# EasyEDA Pro project Laser Tanks Motherboard V4.eprj

# Schematic Schematic1
Board Name: Board1; Create Date: 2025-03-12; Page Name: P1; Project Name: Laser Tanks Tank Motherboard; Schematic Name: Schematic1; Update Date: 2025-07-31; Company: EasyEDA.com; Page Size: A4; Version: V1.0
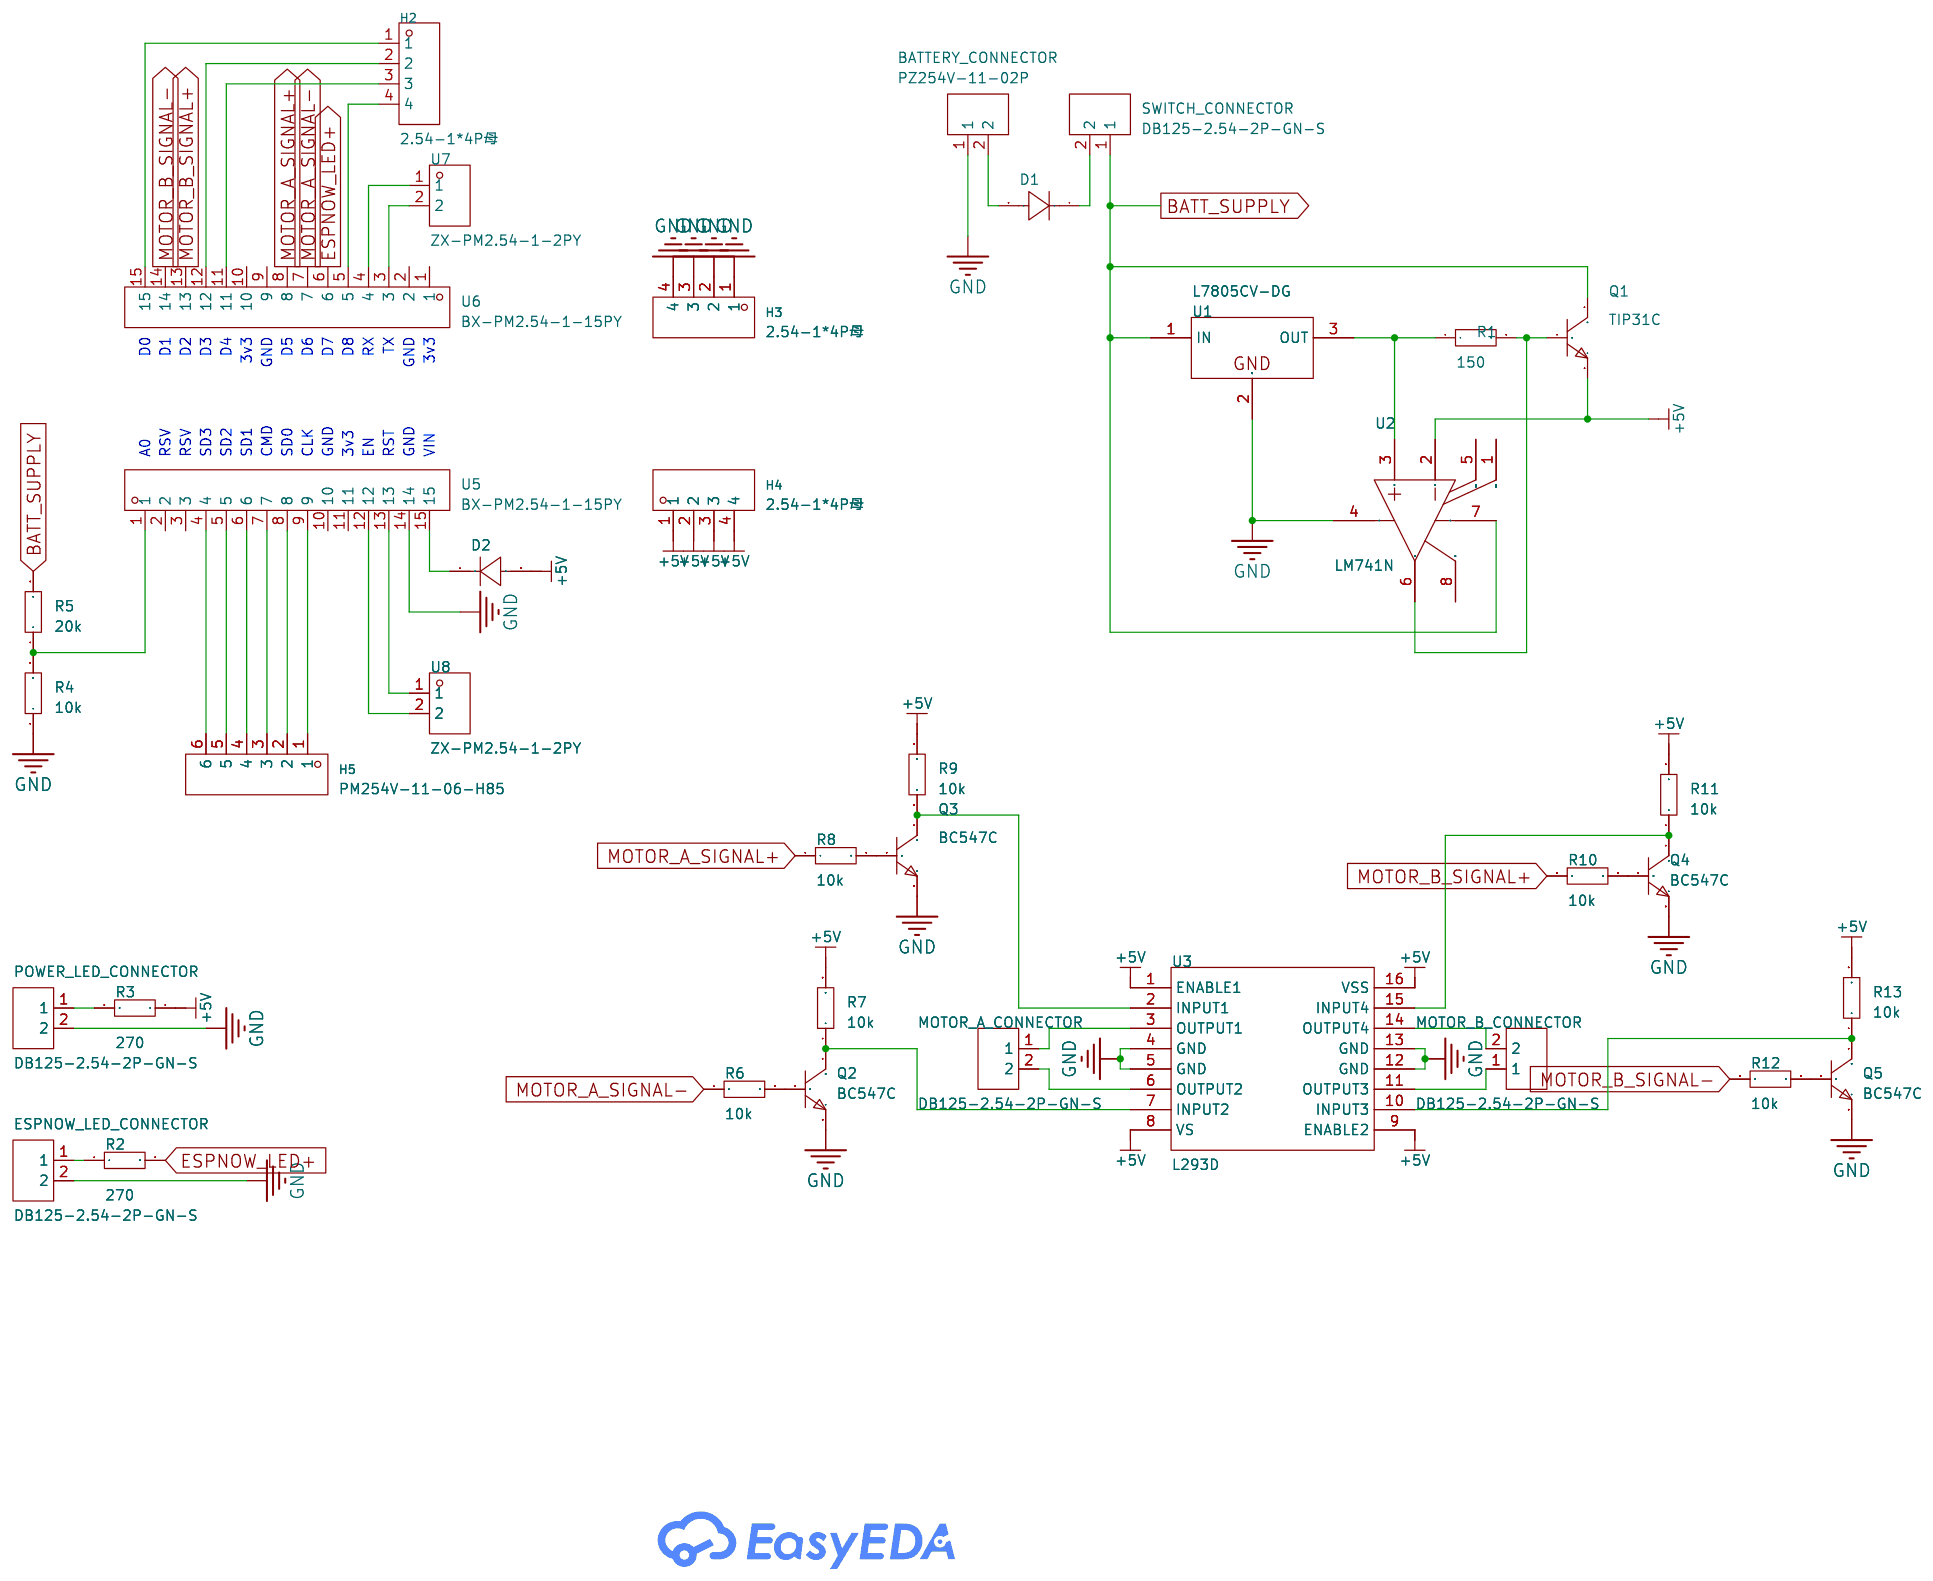
[diagram p0: schematic sheet]

## Parts
BATTERY_CONNECTOR  PZ254V-11-02P  [HDR-TH_2P-P2.54-V-M]
D1  -  [DO-41_BD2.4-L4.7-P8.70-D0.9-RD]
D2  -  [DO-41_BD2.4-L4.7-P8.70-D0.9-RD]
ESPNOW_LED_CONNECTOR  DB125-2.54-2P-GN-S  [CONN-TH_DB125-2.54-2P-GN]
H2  2.54-1*4P母  [HDR-TH_4P-P2.54-V-F]
H3  2.54-1*4P母  [HDR-TH_4P-P2.54-V-F]
H4  2.54-1*4P母  [HDR-TH_4P-P2.54-V-F]
H5  PM254V-11-06-H85  [HDR-TH_6P-P2.54-V-F]
MOTOR_A_CONNECTOR  DB125-2.54-2P-GN-S  [CONN-TH_DB125-2.54-2P-GN]
MOTOR_B_CONNECTOR  DB125-2.54-2P-GN-S  [CONN-TH_DB125-2.54-2P-GN]
POWER_LED_CONNECTOR  DB125-2.54-2P-GN-S  [CONN-TH_DB125-2.54-2P-GN]
Q1  TIP31C  [TO-220-3_L10.0-W4.5-P2.54-T]
Q2  BC547C  [TO-92-3_L4.9-W3.7-P1.27-L]
Q3  BC547C  [TO-92-3_L4.9-W3.7-P1.27-L]
Q4  BC547C  [TO-92-3_L4.9-W3.7-P1.27-L]
Q5  BC547C  [TO-92-3_L4.9-W3.7-P1.27-L]
R1  150  [RES-TH_BD2.3-L6.5-P10.50-D0.5]
R2  270  [RES-TH_BD2.3-L6.5-P10.50-D0.5]
R3  270  [RES-TH_BD2.3-L6.5-P10.50-D0.5]
R4  10k  [RES-TH_BD2.3-L6.5-P10.50-D0.5]
R5  20k  [RES-TH_BD2.3-L6.5-P10.50-D0.5]
R6  10k  [RES-TH_BD2.3-L6.5-P10.50-D0.5]
R7  10k  [RES-TH_BD2.3-L6.5-P10.50-D0.5]
R8  10k  [RES-TH_BD2.3-L6.5-P10.50-D0.5]
R9  10k  [RES-TH_BD2.3-L6.5-P10.50-D0.5]
R10  10k  [RES-TH_BD2.3-L6.5-P10.50-D0.5]
R11  10k  [RES-TH_BD2.3-L6.5-P10.50-D0.5]
R12  10k  [RES-TH_BD2.3-L6.5-P10.50-D0.5]
R13  10k  [RES-TH_BD2.3-L6.5-P10.50-D0.5]
SWITCH_CONNECTOR  DB125-2.54-2P-GN-S  [CONN-TH_DB125-2.54-2P-GN]
U1  L7805CV-DG  [TO-220-3_L10.0-W4.5-P2.54-L]
U2  LM741N  [DIP-8_L9.3-W6.4-P2.54-LS7.6-BL]
U3  L293D  [DIP-16_L20.0-W6.4-P2.54-LS7.6-BL]
U5  BX-PM2.54-1-15PY  [HDR-TH_15P-P2.54-V-F-1]
U6  BX-PM2.54-1-15PY  [HDR-TH_15P-P2.54-V-F-1]
U7  ZX-PM2.54-1-2PY  [HDR-TH_2P-P2.54-V-F]
U8  ZX-PM2.54-1-2PY  [HDR-TH_2P-P2.54-V-F]

## Library data of the parts
BATTERY_CONNECTOR = PZ254V-11-02P: LCSC Part Name: 1x2P 间距:2.54mm 方针 直插; Supplier Part: C492401; Manufacturer: XFCN(兴飞); Supplier Footprint: 插件,P=2.54mm; JLCPCB Part Class: Extended Part; Datasheet: https://atta.szlcsc.com/upload/public/pdf/source/20200309/C492401_A812433581A9B211A7FFA413ADDFF0E5.pdf; Supplier: LCSC; Pin Structure: 1x2P; Pitch: 2.54mm; Circluar Pins/Square Pins: Policy; Mounting Type: Straight; Number of Rows: Single Row; Number of Pins: 2P; Length of Mating Pin: 6mm; Insulation Height: 2.5mm; Length of End Connection Pin: 3mm; Contact Material: Brass; Operating Temperature: -40℃~+105℃; Color: Black
D1 D2 = 1N4007: Supplier Footprint: DO-41
ESPNOW_LED_CONNECTOR MOTOR_A_CONNECTOR MOTOR_B_CONNECTOR POWER_LED_CONNECTOR SWITCH_CONNECTOR = DB125-2.54-2P-GN-S: LCSC Part Name: 2.54mm 1x2P 排数:1 每排P数:2 直插; Supplier Part: C918120; Manufacturer: DORABO(地博电气); Supplier Footprint: 插件,P=2.54mm; JLCPCB Part Class: Extended Part; Datasheet: https://atta.szlcsc.com/upload/public/pdf/source/20230106/BCD3A0BE1EB95DC3E813F1745F022035.pdf; Supplier: LCSC; Number of Positions or Pins: 1x2P; Pitch: 2.54mm; Color: Green; Mounting Type: Direct Insert; Number of Pins: 2P; Number of Rows: 1; Number of PINs Per Row: 2; Current Rating: 8A; Voltage Rating (Max): 130V; Wire Gauge - AWG: 18~26; Wire Gauge - mm2: 0.5~1; Operating Temperature: -40℃~+105℃
H2-H4 = 2.54-1*4P母: LCSC Part Name: 间距:2.54mm 1x4P 直插; Supplier Part: C2718488; Manufacturer: BOOMELE(博穆精密); Supplier Footprint: 插件,P=2.54mm; JLCPCB Part Class: Extended Part; Datasheet: https://atta.szlcsc.com/upload/public/pdf/source/20210301/C2718488_F4427B881E42CAA8DDB0B1C12B3A522C.pdf; Supplier: LCSC; Holes Structure: 1x4P; Pitch: 2.54mm; Circular Hole / Square Hole: Square Holes; Mounting Type: Straight; Number of Rows: Plugin; Number of Holes: 4P; Current Rating (Max): 3A; Holes Direction: Top; Contact Material: bronze; Operating Temperature Range: -40℃~+105℃
H5 = PM254V-11-06-H85: LCSC Part Name: 间距:2.54mm 1x6P 直插; Supplier Part: C2832269; Manufacturer: XFCN(兴飞); Supplier Footprint: 插件,P=2.54mm; JLCPCB Part Class: Extended Part; Datasheet: https://atta.szlcsc.com/upload/public/pdf/source/20210514/C2832269_B3EC97736B37C2783BDCE3050AA57447.pdf; Supplier: LCSC; Holes Structure: 1x6P; Pitch: 2.54mm; Circular Hole / Square Hole: Square Holes; Mounting Type: Straight; Number of Rows: Plugin; Number of Holes: 6P; Current Rating (Max): 3A; Voltage Rating (Max): 250V; Holes Direction: Top; Operating Temperature Range: -40℃~+105℃
Q1 = TIP31C_C13506: LCSC Part Name: NPN 电流:3A 耐压:100V; Supplier Part: C13506; Manufacturer: ST(意法半导体); Supplier Footprint: TO-220; JLCPCB Part Class: Extended Part; Datasheet: https://atta.szlcsc.com/upload/public/pdf/source/20140724/1457707158308.pdf; Supplier: LCSC; DC Current Gain (hFE@Ic,Vce): 10@3A,4V; Collector Cut-Off Current (Icbo): 0.3mA; Collector-Emitter Saturation Voltage (VCE(sat)@Ic,Ib): 1.2V@3A,375mA; Operating Temperature: -65℃~+150℃
Q2-Q5 = BC547C: LCSC Part Name: NPN 电流:100mA 耐压:45V; Supplier Part: C713614; Manufacturer: LGE(鲁光); Supplier Footprint: TO-92-3; JLCPCB Part Class: Extended Part; Datasheet: https://atta.szlcsc.com/upload/public/pdf/source/20200731/C713612_A87215DC84F647A4351B6D1248DC2A9A.pdf; Supplier: LCSC; DC Current Gain (hFE@Ic,Vce): 610@2mA,1V; Transition Frequency (fT): 150MHz; Collector Cut-Off Current (Icbo): 100nA; Collector-Emitter Saturation Voltage (VCE(sat)@Ic,Ib): 300mV; Operating Temperature: -55℃~+150℃
R1-R13 = MF1/4W-4.7KΩ±1% T: Type:Metal Film Resistors Resistance: Tolerance:±1% Tolerance:±1% Voltage-Supply(Max):250V Power(Watts):250mW Temperature Coefficient:±100ppm/℃ Temperature Coefficient:±100ppm/℃ Operating Temperature:-55℃~+155℃ Operating Temperature:-55℃~+155℃; LCSC Part Name: 4.7kΩ ±1% 250mW 金属膜电阻; Supplier Part: C119339; Manufacturer: CCO(千志电子); Supplier Footprint: 插件,D2.3xL6.5mm; JLCPCB Part Class: Extended Part; Datasheet: https://atta.szlcsc.com/upload/public/pdf/source/20190910/C427326_62A6D058BC0FF74963A2F22379CA06CE.pdf; Supplier: LCSC; Type: Metal Film Resistors; Tolerance: ±1%; Voltage-Supply(Max): 250V; Power(Watts): 250mW; Temperature Coefficient: ±100ppm/℃; Operating Temperature: -55℃~+155℃
U1 = L7805CV-DG: LCSC Part Name: 正稳压器IC; Supplier Part: C3795; Manufacturer: ST(意法半导体); Supplier Footprint: TO-220; JLCPCB Part Class: Extended Part; Datasheet: https://atta.szlcsc.com/upload/public/pdf/source/20140724/1457707163191.pdf; Supplier: LCSC; Output Type: Fixed; Maximum Input Voltage: 35V; Output Voltage: 5V; Output Current: 1.5A; Power Supply Rejection Ratio (PSRR): 62dB@(120Hz); Dropout Voltage: 2V@(1A); standby current: 8mA; Feature: Short-Circuit  Protection；Thermal Protection(TSD)；Overcurrent Protection(OCP); Operating Temperature: 0℃~+125℃; Output Polarity: Positive electrode; Number of Outputs: 1
U2 = LM741N: LCSC Part Name: LM741通用运算放大器; Supplier Part: C22446595; Manufacturer: HGSEMI(华冠); Supplier Footprint: DIP-8; JLCPCB Part Class: Extended Part; Datasheet: https://atta.szlcsc.com/upload/public/pdf/source/20240606/252C9569AA98CFB9FE0ED3A6E7F4B9A7.pdf; Supplier: LCSC; Number of Circuits: Single channel; Voltage - Input Offset(Vos): 5mV; Slew Rate(SR): 0.5V/us; Common Mode Rejection Ratio (CMRR): 90dB; Operating Temperature: 0℃~+70℃
U3 = L293D_C12340: LCSC Part Name: 600mA 有刷直流电机驱动芯片 36V; Supplier Part: C12340; Manufacturer: ST(意法半导体); Supplier Footprint: DIP-16; JLCPCB Part Class: Extended Part; Datasheet: https://atta.szlcsc.com/upload/public/pdf/source/20140724/1457707157802.pdf; Supplier: LCSC
U5 U6 = BX-PM2.54-1-15PY: LCSC Part Name: 1x15P 间距:2.54mm 直插; Supplier Part: C18078136; Manufacturer: Bossie(博锡); Supplier Footprint: 插件,P=2.54mm; JLCPCB Part Class: Extended Part; Datasheet: https://atta.szlcsc.com/upload/public/pdf/source/20231017/E7C87C5FAA326EA1BCED90F41F0BE953.pdf; Supplier: LCSC; Holes Structure: 1x15P; Pitch: 2.54mm; Circular Hole / Square Hole: Square Hole; Mounting Type: Direct Insert; Number of Rows: Single Row; Number of Holes: 15P; Voltage Rating (Max): 1kV; Holes Direction: Top; Insulation Height: 8.5mm; Contact Plating: Gold; Operating Temperature Range: -40℃~+105℃; Soldering Temperature(Max): 260℃@5S
U7 U8 = ZX-PM2.54-1-2PY: LCSC Part Name: 1x2P 间距:2.54mm 直插; Supplier Part: C7499322; Manufacturer: Megastar(兆星); Supplier Footprint: 插件,P=2.54mm; JLCPCB Part Class: Extended Part; Datasheet: https://atta.szlcsc.com/upload/public/pdf/source/20231122/F22175ABE3DCBFEB9E36A2E7DA44623C.pdf; Supplier: LCSC; Holes Structure: 1x2P; Pitch: 2.54mm; Circular Hole / Square Hole: Square Hole; Mounting Type: Direct Insert; Number of Rows: Single Row; Number of Holes: 2P; Voltage Rating (Max): 1kV; Holes Direction: Top; Insulation Height: 8.5mm; Contact Plating: Gold; Operating Temperature Range: -40℃~+105℃; Soldering Temperature(Max): 260℃@5S

## Nets
+5V: D2.2(A) H4.1 H4.2 H4.3 H4.4 Q1.3(E) R3.1 R7.2 R9.2 R11.2 R13.2 U2.2(-IN) U3.1(ENABLE1) U3.8(VS) U3.9(ENABLE2) U3.16(VSS)
GND: BATTERY_CONNECTOR.1 ESPNOW_LED_CONNECTOR.2 H3.1 H3.2 H3.3 H3.4 POWER_LED_CONNECTOR.2 Q2.3(E) Q3.3(E) Q4.3(E) Q5.3(E) R4.1 U1.2(GND) U2.4(V-) U3.4(GND) U3.5(GND) U3.12(GND) U3.13(GND) U5.14
BATT_SUPPLY: Q1.2(C) R5.2 SWITCH_CONNECTOR.1 U1.1(IN) U2.7(V+)
ESPNOW_LED+: R2.2 U6.6
MOTOR_A_SIGNAL+: R8.1 U6.8
MOTOR_A_SIGNAL-: R6.1 U6.7
MOTOR_B_SIGNAL+: R10.1 U6.13
MOTOR_B_SIGNAL-: R12.1 U6.14
$1N457: BATTERY_CONNECTOR.2 D1.2(A)
$1N1221: Q1.1(B) R1.2 U2.6(OUT)
$1N2036: R4.2 R5.1 U5.1
$1N10174: Q3.2(B) R8.2
$1N10175: Q2.2(B) R6.2
$1N10193: Q5.2(B) R12.2
$1N10200: Q5.1(C) R13.1 U3.10(INPUT3)
$1N10623: R1.1 U1.3(OUT) U2.3(+IN)
$1N11035: D2.1(K) U5.15
$1N11313: Q4.2(B) R10.2
$1N11315: Q4.1(C) R11.1 U3.15(INPUT4)
$1N11419: Q2.1(C) R7.1 U3.7(INPUT2)
$1N11580: D1.1(K) SWITCH_CONNECTOR.2
$1N11617: MOTOR_B_CONNECTOR.2 U3.14(OUTPUT4)
$1N11623: MOTOR_B_CONNECTOR.1 U3.11(OUTPUT3)
$1N11647: MOTOR_A_CONNECTOR.1 U3.3(OUTPUT1)
$1N11652: MOTOR_A_CONNECTOR.2 U3.6(OUTPUT2)
$1N12198: Q3.1(C) R9.1 U3.2(INPUT1)
$1N14456: H5.6 U5.4
$1N14458: H5.5 U5.5
$1N14460: H5.4 U5.6
$1N14464: H5.2 U5.8
$1N14466: H5.1 U5.9
$1N14472: U5.12 U8.2
$1N14474: U5.13 U8.1
$1N14884: H2.1 U6.15
$1N14895: H2.3 U6.11
$1N14901: H2.4 U6.5
$1N15015: U6.3 U7.2
$1N15020: U6.4 U7.1
$1N17013: H5.3 U5.7
$1N17025: POWER_LED_CONNECTOR.1 R3.2
$1N17035: ESPNOW_LED_CONNECTOR.1 R2.1
$1N19581: H2.2 U6.12

Not connected (* = marked no-connect by the designer): U2 1(OFFSET NULL) 5(OFFSET NULL) 8(NC); U5 2 3 10 11; U6 1 2 9 10

## Notes on the sheet
- D0
- D1
- D2
- D3
- D4
- 3v3
- GND
- D5
- D6
- D7
- D8
- RX
- TX
- GND
- 3v3
- A0
- RSV
- RSV
- SD3
- SD2
- SD1
- CMD
- SD0
- CLK
- GND
- 3v3
- EN
- RST
- GND
- VIN

# Board Original
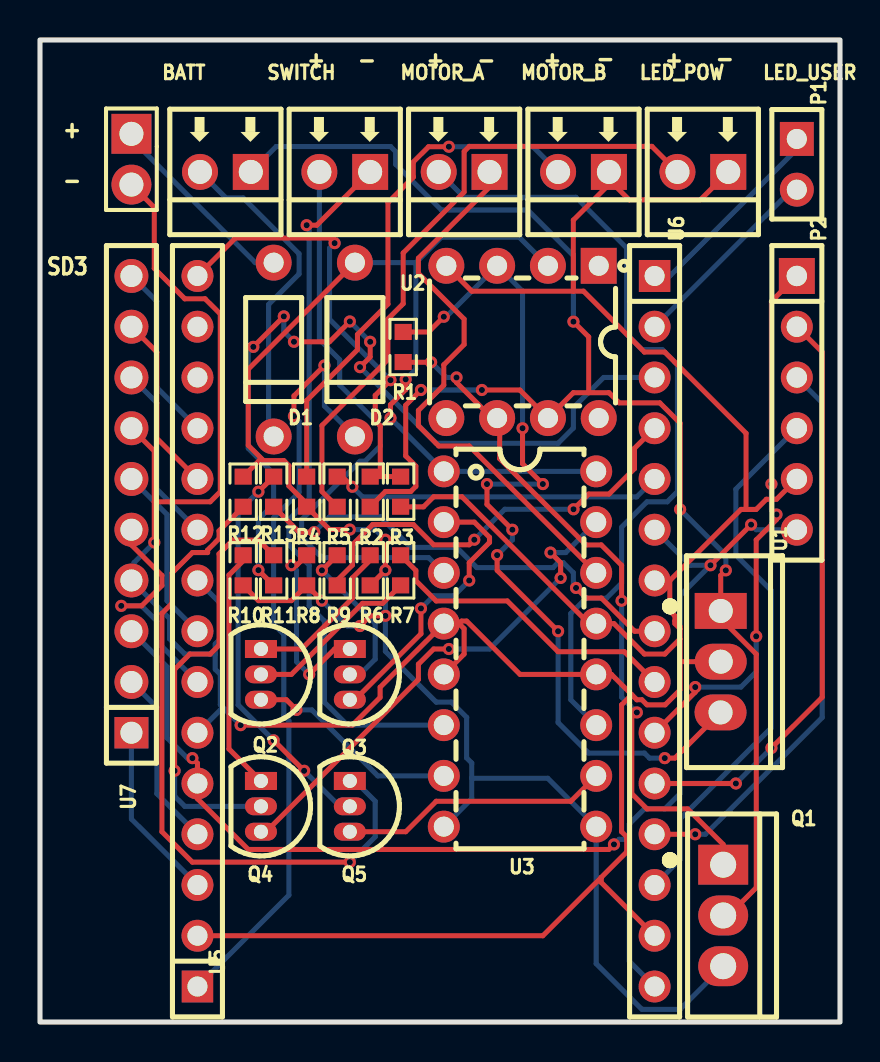
[diagram p1: board, top side]
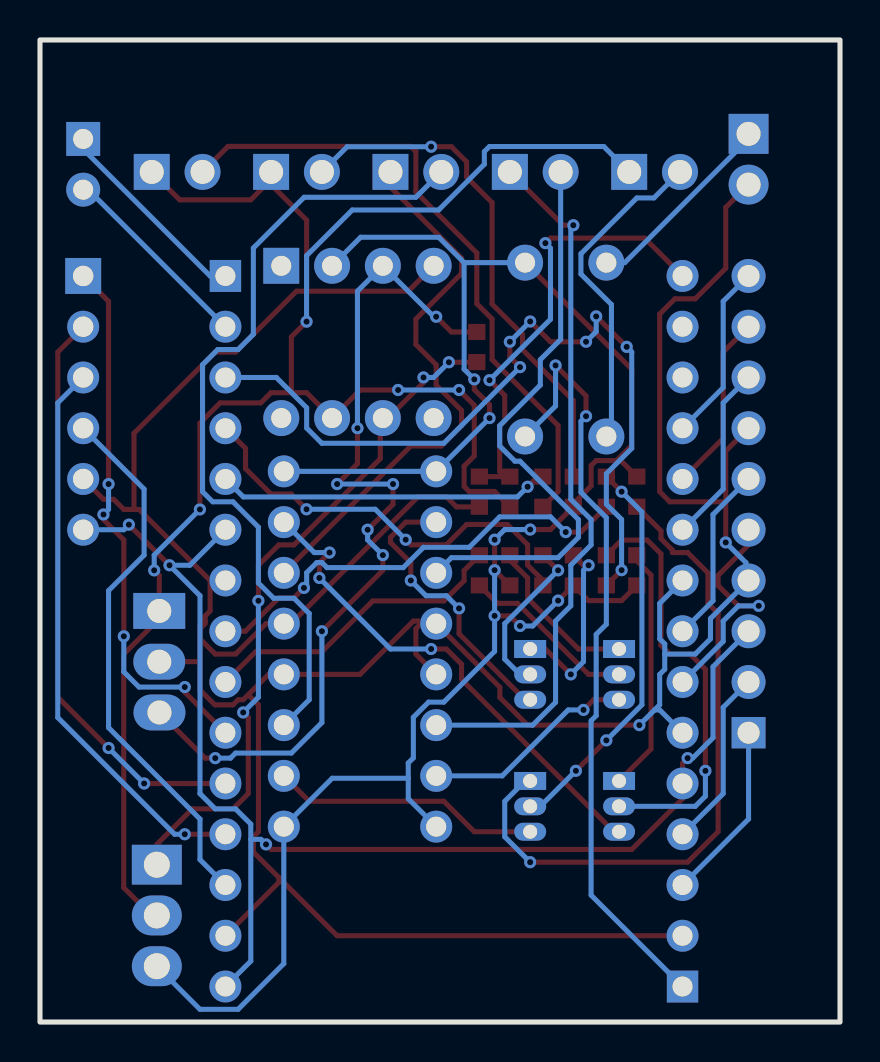
[diagram p2: board, bottom side, seen from below]

Outline 40 x 49.15 mm; copper layers: Top Layer, Bottom Layer. Coordinates in mm from the lower left corner of the outline.
Outline path: rectangle 0,49.15 40,0
Stack: Top Layer 0.035mm / Dielectric1 1.51mm FR4 er 4.5 / Bottom Layer 0.035mm

## Design rules (mm)
template: JLCPCB Capability(Two Layers Board)
spacing copperThickness1oz (default): track to track 0.102, other pairs 0.152 to 0.3
spacing copperThickness2oz: track to track 0.203, other pairs 0.152 to 0.3
track width copperThickness1oz (default): min 0.127, default 0.254, max 2.54
track width copperThickness2oz: min 0.203, default 0.254, max 2.54
differential pair differentialPair (default): width min 0.127, default 0.254, max 2.54; gap min 0.152, default 0.152
via viaSize (default): diameter min 0.5, default 0.61, max 10; hole min 0.3, default 0.305, max 6.3

## Placement (name value [footprint] x y rotation side)
BATT  PZ254V-11-02P  [HDR-TH_2P-P2.54-V-M]  4.57 43.18 270 top
D1  -  [DO-41_BD2.4-L4.7-P8.70-D0.9-RD]  11.68 33.66 90 top
D2  -  [DO-41_BD2.4-L4.7-P8.70-D0.9-RD]  15.75 33.66 90 top
LED_POW  DB125-2.54-2P-GN-S  [CONN-TH_DB125-2.54-2P-GN]  27.18 42.54 180 top
LED_USER  DB125-2.54-2P-GN-S  [CONN-TH_DB125-2.54-2P-GN]  33.15 42.54 180 top
MOTOR_A  DB125-2.54-2P-GN-S  [CONN-TH_DB125-2.54-2P-GN]  15.24 42.54 180 top
MOTOR_B  DB125-2.54-2P-GN-S  [CONN-TH_DB125-2.54-2P-GN]  21.21 42.54 180 top
P1  2.54-1*2P母  [HDR-TH_2P-P2.54-V-F]  37.85 42.93 270 top
P2  2.54-1*6P母  [HDR-TH_6P-P2.54-V-F]  37.85 30.99 270 top
Q1  TIP31C  [TO-220-3_L10.0-W4.5-P2.54-T]  34.16 5.33 0 top
Q2  BC547C  [TO-92-3_L4.9-W3.7-P1.27-L]  11.05 17.4 270 top
Q3  BC547C  [TO-92-3_L4.9-W3.7-P1.27-L]  15.49 17.4 270 top
Q4  BC547C  [TO-92-3_L4.9-W3.7-P1.27-L]  11.05 10.79 270 top
Q5  BC547C  [TO-92-3_L4.9-W3.7-P1.27-L]  15.49 10.79 270 top
R1  220  [R0603]  18.16 33.78 270 top
R2  20k  [R0603]  16.51 26.54 270 top
R3  10k  [R0603]  18.03 26.54 90 top
R4  270  [R0603]  13.34 26.54 90 top
R5  270  [R0603]  14.86 26.54 270 top
R6  1k  [R0603]  16.51 22.61 270 top
R7  1k  [R0603]  18.03 22.61 270 top
R8  1k  [R0603]  13.34 22.61 270 top
R9  1k  [R0603]  14.86 22.61 90 top
R10  1k  [R0603]  10.16 22.61 270 top
R11  1k  [R0603]  11.68 22.61 90 top
R12  1k  [R0603]  10.16 26.54 90 top
R13  1k  [R0603]  11.68 26.54 90 top
SWITCH  DB125-2.54-2P-GN-S  [CONN-TH_DB125-2.54-2P-GN]  9.27 42.54 180 top
U1  L7805CV-DG  [TO-220-3_L10.0-W4.5-P2.54-L]  34.04 18.03 270 top
U2  LM741N  [DIP-8_L9.3-W6.4-P2.54-LS7.6-BL]  24.13 34.04 180 top
U3  L293D  [DIP-16_L20.0-W6.4-P2.54-LS7.6-BL]  24 18.67 270 top
U5  BX-PM2.54-1-15PY  [HDR-TH_15P-P2.54-V-F-1]  7.87 19.56 90 top
U6  BX-PM2.54-1-15PY  [HDR-TH_15P-P2.54-V-F-1]  30.73 19.56 270 top
U7  PM2.54-1*10  [HDR-TH_10P-P2.54-V-F]  4.57 25.91 90 top

## Footprints (pads in the part's own frame, mm; a bottom-side part is the same pattern mirrored in y, then rotated)
CONN-TH_DB125-2.54-2P-GN
  rect 1.8x1.8 hole 1.2: 1(-1.27,0)
  round 1.8 hole 1.2: 2(1.27,0)
DIP-8_L9.3-W6.4-P2.54-LS7.6-BL
  rect 1.8x1.8 hole 1: 1(-3.81,-3.81)
  round 1.8 hole 1: 2(-1.27,-3.81) 3(1.27,-3.81) 4(3.81,-3.81) 5(3.81,3.81) 6(1.27,3.81) 7(-1.27,3.81) 8(-3.81,3.81)
DIP-16_L20.0-W6.4-P2.54-LS7.6-BL
  round 1.6 hole 1: 1(-8.89,-3.81) 2(-6.35,-3.81) 3(-3.81,-3.81) 4(-1.27,-3.81) 5(1.27,-3.81) 6(3.81,-3.81) 7(6.35,-3.81) 8(8.89,-3.81) 9(8.89,3.81) 10(6.35,3.81) 11(3.81,3.81) 12(1.27,3.81) 13(-1.27,3.81) 14(-3.81,3.81) 15(-6.35,3.81) 16(-8.89,3.81)
DO-41_BD2.4-L4.7-P8.70-D0.9-RD
  round 1.8 hole 1: 1(-4.35,0) 2(4.35,0)
HDR-TH_2P-P2.54-V-F
  rect 1.7x1.7 hole 1: 1(-1.27,0)
  round 1.7 hole 1: 2(1.27,0)
HDR-TH_2P-P2.54-V-M
  rect 2x2 hole 1.2: 1(-1.27,0)
  round 2 hole 1.2: 2(1.27,0)
HDR-TH_6P-P2.54-V-F
  rect 1.8x1.8 hole 1.02: 1(-6.35,0)
  round 1.6 hole 1.02: 2(-3.81,0) 3(-1.27,0) 4(1.27,0) 5(3.81,0) 6(6.35,0)
HDR-TH_10P-P2.54-V-F
  rect 1.575x1.7 hole 1.1: 1(-11.43,0)
  round 1.7 hole 1.1: 2(-8.89,0) 3(-6.35,0) 4(-3.81,0) 5(-1.27,0) 6(1.27,0) 7(3.81,0) 8(6.35,0) 9(8.89,0) 10(11.43,0)
HDR-TH_15P-P2.54-V-F-1
  rect 1.6x1.575 hole 1: 1(-17.78,0)
  round 1.6 hole 1: 2(-15.24,0) 3(-12.7,0) 4(-10.16,0) 5(-7.62,0) 6(-5.08,0) 7(-2.54,0) 8(0,0) 9(2.54,0) 10(5.08,0) 11(7.62,0) 12(10.16,0) 13(12.7,0) 14(15.24,0) 15(17.78,0)
R0603
  rect 0.806x0.864 smd: 1(-0.753,0) 2(0.753,0)
TO-92-3_L4.9-W3.7-P1.27-L
  rect 0.9x1.6 hole 0.7: 1(-1.27,0)
  oval 0.9x1.6 hole 0.7: 2(0,0) 3(1.27,0)
TO-220-3_L10.0-W4.5-P2.54-L
  rect 1.8x2.6 hole 1.2: 1(-2.54,0.005)
  oval 1.8x2.6 hole 1.2: 2(0,0.005) 3(2.54,-0.005)
TO-220-3_L10.0-W4.5-P2.54-T
  rect 2.5x2 hole 1.3: 1(0,2.54)
  oval 2.5x2 hole 1.3: 2(0,0) 3(0,-2.54)

## Nets
3V3: P2.6 U5.5 U6.6 U6.15 U7.3
GND: BATT.2 LED_POW.1 LED_USER.1 P2.5 R3.1 U1.2 U2.4 U3.4 U3.5 U3.12 U3.13 U5.2 U5.6 U5.9 U6.7 U6.14 U7.4 U7.7
VIN: D2.1 U5.1
A0: R2.1 R3.2 U5.15
BATT+: BATT.1 D1.2
BATT_SUPPLY: Q1.2 R2.2 SWITCH.1 U1.1 U2.7
CIRCUIT_SUPPLY: D2.2 Q1.3 R4.1 R6.2 R8.2 R10.2 R12.2 U2.2 U3.1 U3.8 U3.9 U3.16
CIRCUIT_SUPPLY_FEEDBACK: Q1.1 R1.2 U2.6
CLK: U5.7 U7.5
D0: P1.1 U6.1
D1: P1.2 U6.2
D2: R11.1 U6.3
D3: R9.1 U6.4
D4: R5.1 U6.5
D5: R13.1 U6.8
D6: R7.1 U6.9
D7: P2.1 U6.10
D8: P2.2 U6.11
EN: U5.4 U7.2
ESPNOW_LED+: LED_USER.2 R5.2
MOTOR_A+: MOTOR_A.2 U3.3
MOTOR_A-: MOTOR_A.1 U3.6
MOTOR_B+: MOTOR_B.2 U3.11
MOTOR_B-: MOTOR_B.1 U3.14
POWER_LED+: LED_POW.2 R4.2
RST: U5.3 U7.1
RSV_1: U5.14
RSV_2: U5.13
RX: P2.3 U6.12
SD0: U5.8 U7.6
SD1: U5.10 U7.8
SD2: U5.11 U7.9
SD3: U5.12 U7.10
SWITCH_A: D1.1 SWITCH.2
TX: P2.4 U6.13
$1N854: R1.1 U1.3 U2.3
$1N2650: Q2.1 R6.1
$1N2706: Q2.2 R7.2
$1N2823: Q3.1 R8.1
$1N2827: Q3.2 R9.2
$1N3129: Q3.3 U3.2
$1N3133: Q2.3 U3.7
$1N3356: Q4.1 R10.1
$1N3360: Q4.2 R11.2
$1N3364: Q5.1 R12.1
$1N3368: Q5.2 R13.2
$1N3378: Q4.3 U3.15
$1N3382: Q5.3 U3.10

Pads without a net: U2 1 5 8

## Via types
v1: diameter 0.61, hole 0.305, Top Layer to Bottom Layer, 71 vias

## Routing (per net, layer and track width the routed paths; a pad name or vN(x,y) marks a point on that pad's centre or on a via; arc(x,y) is an arc through that point)
3V3: length 65.4
  Top Layer w0.254: v1(28.7,8.89) 28.45,8.64 10.41,8.64 7.87,11.18 U5.5 7.87,12.95 v1(7.62,13.21) ; v1(35.56,24.89) v1(33.53,22.86)
  Bottom Layer w0.254: 29.46,9.14 28.96,9.14 v1(28.7,8.89) ; 29.46,9.14 29.46,3.05 U6.15 ; 29.46,9.14 29.46,9.91 30.23,10.67 31.24,10.67 32,11.43 32,21.34 v1(33.53,22.86) 32.51,22.86 U6.6 ; v1(7.62,13.21) 7.37,13.21 6.35,14.22 6.35,17.78 U7.3 ; P2.6 35.81,24.64 v1(35.56,24.89)
GND: length 182.6
  Top Layer w0.254: 29.59,16.38 28.57,17.4 U3.12 24,17.4 21.34,20.07 21.08,20.07 20.96,19.94 ; 29.59,16.38 29.84,16.13 30.1,16.13 30.35,15.88 31.26,15.88 32,16.62 32,18.03 ; 29.59,16.38 29.08,15.88 29.08,9.52 29.34,9.27 29.34,8.51 28.07,7.24 ; 31.5,22.1 31.5,20.57 31.75,20.32 31.75,20.07 ; 31.5,22.1 U6.7 ; 31.5,22.1 35.05,25.65 35.31,25.65 ; U5.2 25.15,4.32 28.07,7.24 ; 28.07,7.24 28.07,6.98 U6.14 ; 31.75,20.07 31.75,19.94 32,19.68 ; 31.75,20.07 32,19.81 32,19.68 ; 28.45,42.16 28.45,41.91 26.67,40.13 26.67,36.58 ; 28.45,42.16 LED_POW.1 ; 28.45,42.16 29.46,41.15 33.02,41.15 LED_USER.1 ; 32,18.03 32,19.18 ; 32,18.03 U1.2 ; P2.5 36.83,26.16 36.32,26.16 35.81,25.65 35.31,25.65 ; R3.1 18.04,25.78 19.18,25.78 19.69,26.29 21.1,26.29 27.45,19.94 U3.13 28.7,19.94 30.23,18.41 31.24,18.41 32,19.18 ; 32,19.18 32,19.68 ; 26.67,36.58 27.18,36.58 30.23,33.53 31.24,33.53 35.31,29.46 35.31,25.65 ; 26.67,36.58 21.59,36.58 U2.4 ; BATT.2 5.72,40.77 5.72,37.72 7.24,36.19 8.25,36.19 9.02,35.43 9.02,26.54 8.51,26.03 5.72,26.03 ; 20.96,19.94 21.21,19.68 21.21,18.41 U3.5 ; 20.96,19.94 U3.4 17.01,16.75 17.01,16.25 15.62,14.86 v1(10.03,14.86) ; 5.72,26.03 5.72,28.57 U7.7 ; 5.72,26.03 v1(5.72,24)
  Bottom Layer w0.254: 4.7,21.97 6.48,20.19 6.48,19.18 7.24,18.41 8.76,18.41 ; 4.7,21.97 4.7,22.99 v1(5.72,24) ; 4.7,21.97 U7.4 ; 8.76,18.41 8.76,17.65 9.02,17.4 9.02,15.88 9.27,15.62 ; 8.76,18.41 8.76,18.92 9.02,19.18 9.02,20.95 U5.9 ; 9.27,15.62 9.02,15.62 U5.6 ; 9.27,15.62 v1(10.03,14.86)
VIN: length 38.7
  Top Layer w0.254: v1(12.7,30.32) 12.7,31.34 v1(14.22,32.86)
  Bottom Layer w0.254: v1(14.22,32.86) 14.22,30.83 D2.1 ; U5.1 12.45,6.35 12.45,15.08 12.19,15.33 12.19,19.4 11.68,19.91 11.68,25.24 12.95,26.51 12.95,30.07 v1(12.7,30.32)
A0: length 22.9
  Top Layer w0.254: v1(17.53,32.12) 16.76,31.36 16.76,30.09 17.02,29.84 17.02,27.55 16.76,27.3 ; U5.15 9.77,39.23 14.48,39.23 v1(14.73,38.98) ; R2.1 16.76,27.3 ; 16.76,27.3 R3.2
  Bottom Layer w0.254: v1(17.53,32.12) 14.48,35.17 14.48,38.73 v1(14.73,38.98)
BATT+: length 9.9
  Bottom Layer w0.254: D1.2 10.76,38 4.67,44.1 4.67,44.35 BATT.1
BATT_SUPPLY: length 76.5
  Top Layer w0.254: v1(22.1,31.63) 23.99,31.63 25.4,30.23 26.67,31.5 27.44,31.5 ; v1(34.3,22.61) 34.04,22.35 U1.1 34.04,20.19 35.82,18.41 35.82,6.73 34.43,5.33 Q1.2 ; v1(26.68,35.05) 27.44,34.29 27.44,31.5 ; v1(32.01,25.65) 32.01,29.97 30.99,30.99 28.96,30.99 28.45,31.5 27.44,31.5 ; R2.2 17.27,26.55 18.54,26.55 18.8,26.81 18.8,27.82 18.29,28.33 18.29,30.87 v1(19.05,31.63)
  Bottom Layer w0.254: v1(32.01,25.65) 34.3,23.37 v1(34.3,22.61) ; SWITCH.1 11.81,43.81 17.53,43.81 17.78,43.56 17.78,42.93 20.07,40.64 24.39,40.64 26.68,38.35 v1(26.68,35.05) ; v1(22.1,31.63) v1(19.05,31.63)
CIRCUIT_SUPPLY: length 102
  Top Layer w0.254: v1(17.27,20.33) 16.51,20.33 v1(16,19.82) ; 11.18,28.1 10.96,28.1 R12.2 ; 11.18,28.1 10.41,28.86 10.41,32.67 D2.2 ; 11.18,28.1 12.19,28.1 12.45,27.84 12.45,26.83 13.21,26.07 13.21,25.92 14.48,24.65 v1(15.49,24.65) ; v1(17.53,30.23) 17.53,30.89 18.29,31.66 v1(18.29,32.16) ; R10.2 10.92,21.09 12.57,21.09 R8.2 v1(14.1,21.09) ; R6.2 v1(17.27,22.61) v1(17.27,24.14)
  Bottom Layer w0.254: v1(17.53,30.23) U3.1 U3.16 ; 21.59,12.2 25.39,12.2 U3.9 27.81,2.92 30.1,0.63 32,0.63 34.16,2.79 ; 21.59,12.2 21.59,11.18 U3.8 ; 21.59,12.2 21.59,12.96 21.34,13.22 21.34,15.25 20.57,16.01 19.81,16.01 17.27,18.55 v1(17.27,20.33) v1(17.27,22.61) ; D2.2 18.8,38 ; 18.8,38 20.07,39.27 23.97,39.27 U2.2 ; 18.8,38 18.8,32.67 v1(18.29,32.16) ; v1(17.27,24.14) 16.76,24.65 v1(15.49,24.65) ; v1(14.1,21.09) 15.37,19.82 v1(16,19.82)
CIRCUIT_SUPPLY_FEEDBACK: length 34.9
  Top Layer w0.254: v1(29.08,21.08) 29.08,22.86 28.07,23.88 27.31,23.88 22.99,28.19 22.99,30.1 22.86,30.23 22.61,30.23 20.83,32 v1(20.83,32.26) ; Q1.1 34.16,8.89 32.38,10.67 30.35,10.67 29.59,11.43 29.59,15.24 v1(29.84,15.49) ; v1(19.56,33.02) 18.17,33.02 R1.2
  Bottom Layer w0.254: v1(29.08,21.08) 29.08,16.26 v1(29.84,15.49) ; v1(19.56,33.02) 20.32,32.26 v1(20.83,32.26)
CLK: length 11.9
  Top Layer w0.254: U7.5 4.57,23.88 6.1,22.35 6.1,21.84 5.08,20.83 v1(4.06,20.83)
  Bottom Layer w0.254: v1(4.06,20.83) 5.08,20.83 5.84,20.07 5.84,19.05 7.87,17.02
D0: length 10.3
  Bottom Layer w0.254: U6.1 31.5,37.34 37.85,43.69 P1.1
D1: length 10
  Bottom Layer w0.254: P1.2 37.59,41.66 U6.2
D2: length 41.2
  Top Layer w0.254: v1(16.51,34.04) 16.51,33.28 v1(16,32.77) ; R11.1 v1(10.92,22.61) ; v1(10.67,33.79) v1(12.19,35.31) ; v1(15.49,35.06) 14.48,34.04 v1(12.7,34.04)
  Bottom Layer w0.254: v1(12.19,35.31) 12.19,34.55 v1(12.7,34.04) ; v1(10.67,33.79) 10.41,33.54 10.41,28.71 11.68,27.44 11.68,25.92 10.92,25.15 v1(10.92,22.61) ; v1(16,32.77) 19.81,28.96 25.91,28.96 26.67,29.73 26.67,30.74 28.19,32.26 U6.3 ; v1(15.49,35.06) v1(16.51,34.04)
D3: length 21.3
  Top Layer w0.254: v1(21.72,24.14) 21.46,23.88 19.69,23.88 18.67,24.9 16.64,24.9 15.62,23.88 15.62,22.87 14.86,22.11 R9.1 ; v1(26.68,25.66) 27.44,26.42 28.46,26.42 29.73,27.69 29.73,28.71 U6.4
  Bottom Layer w0.254: v1(26.68,25.66) 23.24,25.66 v1(21.72,24.14)
D4: length 16.7
  Top Layer w0.254: v1(15.62,26.79) 15.11,27.3 R5.1
  Bottom Layer w0.254: v1(15.62,26.79) 16.13,26.28 29.84,26.28 U6.5
D5: length 22.8
  Top Layer w0.254: U6.8 29.74,19.56 28.08,21.22 27.31,21.22 v1(26.81,21.73) ; v1(13.72,24.52) 12.95,24.52 R13.1
  Bottom Layer w0.254: v1(26.81,21.73) 26.67,21.86 26.67,22.49 26.16,23 25.91,23 25.65,22.74 21.84,22.74 20.83,23.76 18.54,23.76 17.02,25.28 14.48,25.28 v1(13.72,24.52)
D6: length 15.6
  Top Layer w0.254: 30.73,17.02 29.22,18.53 25.91,18.53 23.37,21.07 19.81,21.07 18.8,22.09 18.8,22.6 R7.1
D7: length 27.4
  Top Layer w0.254: v1(35.81,19.3) 35.81,24.13 36.83,25.15 v1(36.83,25.4) ; P2.1 36.58,36.07 v1(36.58,26.92) ; v1(32.77,16.76) 32.77,16.51 U6.10
  Bottom Layer w0.254: v1(32.77,16.76) 35.05,16.76 35.81,17.53 v1(35.81,19.3) ; v1(36.58,26.92) 36.58,25.65 v1(36.83,25.4)
D8: length 29.2
  Top Layer w0.254: v1(36.58,13.72) 39.12,16.26 39.12,33.53 P2.2 ; v1(34.8,11.94) U6.11
  Bottom Layer w0.254: v1(36.58,13.72) v1(34.8,11.94)
EN: length 9
  Bottom Layer w0.254: U5.4 5.84,11.43 5.84,15.75 U7.2
ESPNOW_LED+: length 32.3
  Top Layer w0.254: LED_USER.2 30.6,43.82 21.46,43.82 21.21,43.57 21.21,41.54 18.16,38.49 18.16,35.95 17.4,35.19 17.4,33.16 14.1,29.85 14.1,26.55 R5.2
MOTOR_A+: length 29.2
  Bottom Layer w0.254: MOTOR_A.2 13.97,34.16 14.99,33.15 14.99,31.88 17.02,29.84 17.02,28.83 16.26,28.07 16,28.07 13.08,25.15 13.08,24.26 14.1,23.24 19.43,23.24 U3.3
MOTOR_A-: length 35.8
  Top Layer w0.254: 16.51,42.54 13.84,39.88 v1(13.34,39.88)
  Bottom Layer w0.254: U3.6 15.37,14.86 14.22,16 14.22,20.07 13.46,20.83 13.46,22.86 12.45,23.88 12.45,25.15 13.46,26.16 13.46,39.75 v1(13.34,39.88)
MOTOR_B+: length 40.4
  Bottom Layer w0.254: U3.11 26.54,16.13 26.54,20.45 27.31,21.21 28.32,21.21 29.08,21.97 29.08,24.77 30.35,26.03 31.37,26.03 31.88,26.54 31.88,32.89 31.12,33.66 30.1,33.66 29.34,34.42 29.34,38.73 26.8,41.27 21.21,41.27 MOTOR_B.2
MOTOR_B-: length 28
  Top Layer w0.254: U3.14 21.46,28.83 19.94,28.83 18.92,29.84 18.92,30.61 20.19,31.88 20.19,32.89 21.21,33.91 21.21,35.18 18.92,37.46 18.92,38.23 22.48,41.78 MOTOR_B.1
POWER_LED+: length 26
  Top Layer w0.254: R4.2 13.34,31.11 15.88,33.65 15.88,34.41 17.4,35.93 17.4,41.01 18.67,42.28 18.67,43.04 19.43,43.81 v1(20.45,43.81)
  Bottom Layer w0.254: v1(20.45,43.81) 24.65,43.81 25.91,42.54
RST: length 9
  Bottom Layer w0.254: U7.1 4.57,10.16 U5.3
RX: length 28.3
  Top Layer w0.254: v1(32.77,9.4) U6.12
  Bottom Layer w0.254: v1(32.77,9.4) 33.27,9.4 39.12,15.24 39.12,30.99 P2.3
SD0: length 9
  Bottom Layer w0.254: U5.8 6.35,21.08 6.35,25.4 U7.6
SD1: length 9
  Bottom Layer w0.254: U5.10 5.84,26.67 5.84,30.99 U7.8
SD2: length 9
  Top Layer w0.254: U5.11 5.84,29.21 5.84,33.53 U7.9
SD3: length 9
  Bottom Layer w0.254: U7.10 5.84,36.07 5.84,31.75 U5.12
SWITCH_A: length 16.5
  Bottom Layer w0.254: D1.1 11.43,29.56 11.43,35.91 12.95,37.43 12.95,38.45 10.16,41.24 9.3,41.24 SWITCH.2
TX: length 27.3
  Bottom Layer w0.254: U6.13 32,8.13 32,10.16 36.58,14.73 36.58,21.59 34.8,23.37 34.8,26.67 P2.4
$1N854: length 44.6
  Top Layer w0.254: v1(23.62,24.64) 22.35,25.91 v1(22.35,26.92) ; v1(25.91,19.56) 22.86,22.61 v1(22.86,23.37) ; R1.1 19.43,34.54 v1(20.19,35.3) ; v1(31.24,13.21) 31.75,13.21 34.03,15.49 ; v1(25.15,26.92) 24.13,27.94 v1(24.13,29.72)
  Bottom Layer w0.254: v1(23.62,24.64) 23.62,24.13 v1(22.86,23.37) ; v1(20.19,35.3) 20.31,35.3 22.86,37.85 24.13,36.58 v1(24.13,29.72) ; v1(31.24,13.21) 30.48,13.21 30.23,13.46 27.43,13.46 25.91,14.99 v1(25.91,19.56) ; v1(25.15,26.92) v1(22.35,26.92)
$1N2650: length 8.1
  Top Layer w0.254: Q2.1 13.08,18.67 15.62,21.21 15.62,22.22 16.51,23.11 R6.1
$1N2706: length 8.8
  Top Layer w0.254: R7.2 17.14,20.95 16.13,20.95 12.57,17.4 Q2.2
$1N2823: length 9.4
  Top Layer w0.254: R8.1 12.84,22.86 v1(12.57,22.86) ; Q3.1 14.73,18.67 v1(13.46,17.4)
  Bottom Layer w0.254: v1(13.46,17.4) 12.83,18.03 12.83,22.61 v1(12.57,22.86)
$1N2827: length 8.2
  Top Layer w0.254: v1(14.1,22.61) R9.2
  Bottom Layer w0.254: Q3.2 16,17.4 16.76,18.16 16.76,19.94 v1(14.1,22.61)
$1N3129: length 14.4
  Top Layer w0.254: U3.2 21.72,25.02 22.48,24.26 22.48,24 21.46,22.99 v1(21.46,22.1) ; Q3.3 15.75,16.13 19.05,19.43 v1(19.05,20.7)
  Bottom Layer w0.254: v1(19.05,20.7) 19.69,21.34 20.7,21.34 v1(21.46,22.1)
$1N3133: length 10.7
  Top Layer w0.254: v1(12.83,15.62) 12.32,16.13 Q2.3
  Bottom Layer w0.254: U3.7 16.89,12.32 13.59,15.62 v1(12.83,15.62)
$1N3356: length 12.3
  Top Layer w0.254: Q4.1 9.45,13.66 9.45,22.37 10.16,23.08 R10.1
$1N3360: length 21.5
  Top Layer w0.254: v1(6.73,12.57) 6.73,17.65 7.49,18.41 8.51,18.41 8.95,18.86 8.95,23.43 9.64,24.12 10.92,24.12 R11.2
  Bottom Layer w0.254: Q4.2 7.24,10.79 6.73,11.3 v1(6.73,12.57)
$1N3364: length 33.7
  Top Layer w0.254: v1(15.49,8) 7.62,8 6.1,9.52 6.1,20.45 6.6,20.95 6.6,22.48 7.62,23.49 8.38,23.49 8.38,23.62 8.95,24.19 8.95,24.58 R12.1
  Bottom Layer w0.254: v1(15.49,8) 16.76,9.27 16.76,11.05 15.75,12.06 Q5.1
$1N3368: length 19.9
  Top Layer w0.254: v1(10.92,26.54) R13.2 ; v1(13.21,12.57) v1(11.68,14.1)
  Bottom Layer w0.254: v1(13.21,12.57) 14.99,10.79 Q5.2 ; v1(11.68,14.1) 9.91,15.88 9.91,25.53 v1(10.92,26.54)
$1N3378: length 25.1
  Top Layer w0.254: v1(26.03,22.22) 26.03,22.99 v1(25.53,23.49) ; v1(20.45,18.67) 19.69,18.67 18.92,17.91 18.92,17.14 11.3,9.52 Q4.3
  Bottom Layer w0.254: v1(20.45,18.67) 22.48,18.67 v1(26.03,22.22) ; v1(25.53,23.49) 26.29,23.49 U3.15
$1N3382: length 13.5
  Top Layer w0.254: U3.10 26.54,11.05 19.81,11.05 18.29,9.52 Q5.3

## Text on the board
Top Silkscreen Layer: + | - | SD3

# Board PCB3
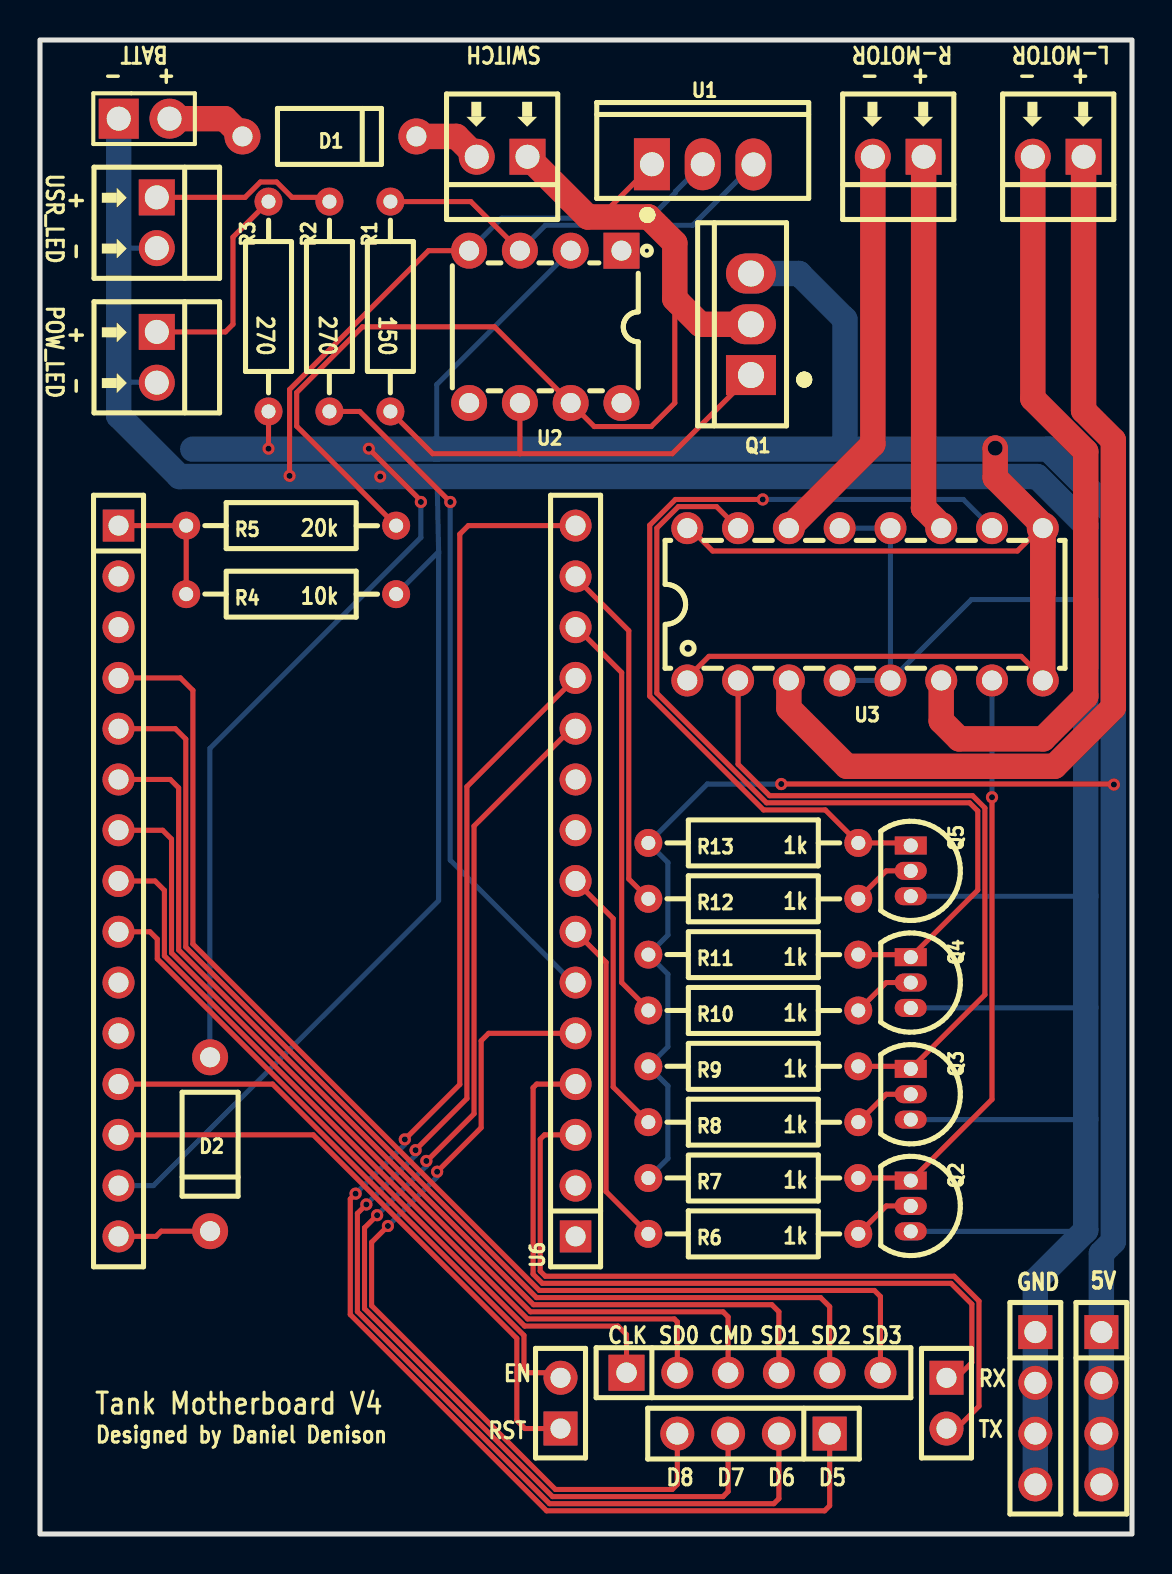
[diagram p3: board, top side]
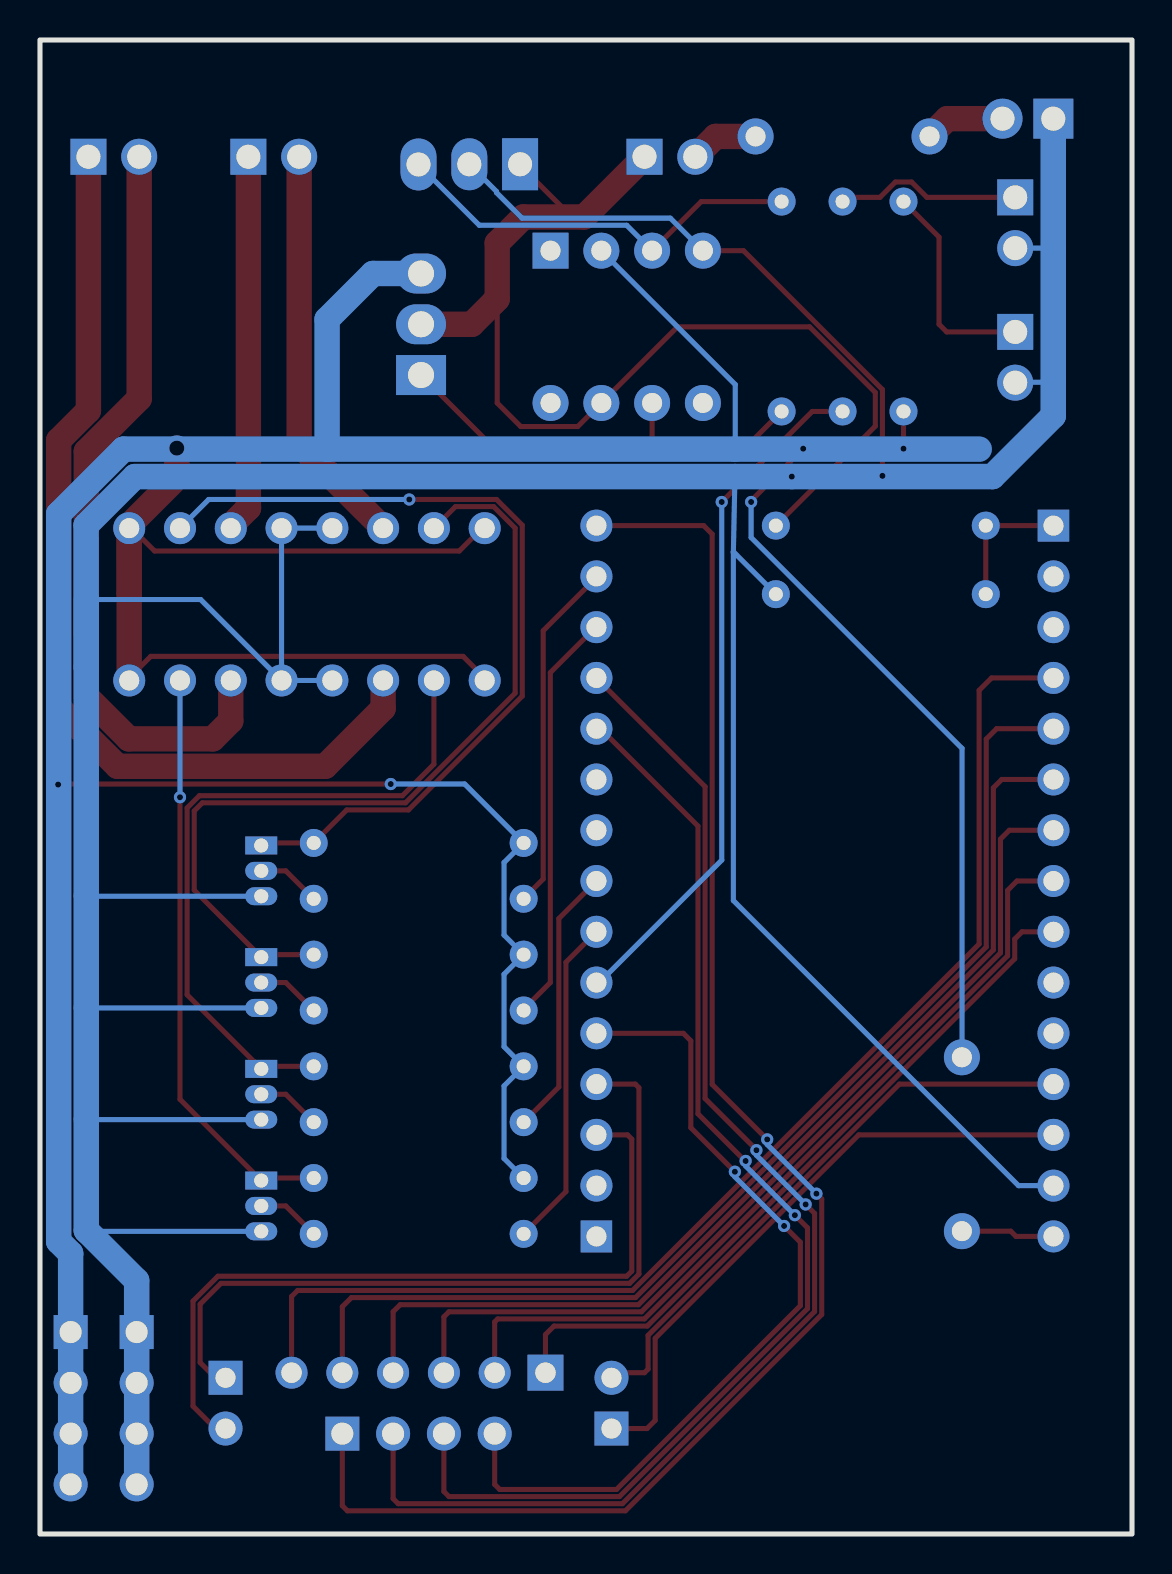
[diagram p4: board, bottom side, seen from below]

Outline 54.62 x 74.75 mm; copper layers: Top Layer, Bottom Layer. Coordinates in mm from the lower left corner of the outline.
Outline path: rectangle 0,74.75 54.62,0
Stack: Top Layer 0.035mm / Dielectric1 1.51mm FR4 er 4.5 / Bottom Layer 0.035mm

## Design rules (mm)
template: Custom Config
spacing copperThickness1oz (default): track to track 0.102, other pairs 0.152 to 0.3
spacing copperThickness2oz: track to track 0.203, other pairs 0.152 to 0.3
track width copperThickness1oz (default): min 0.127, default 0.254, max 2.54
track width copperThickness2oz: min 0.203, default 0.254, max 2.54
track width 3A thickness: min 1.27, default 1.27, max 2.54
track width 2A Thickness: min 0.76, default 0.76, max 2.54
differential pair differentialPair (default): width min 0.127, default 0.254, max 2.54; gap min 0.152, default 0.152
via viaSize (default): diameter min 0.5, default 0.61, max 10; hole min 0.3, default 0.305, max 6.3

## Placement (name value [footprint] x y rotation side)
BATTERY_CONNECTOR  PZ254V-11-02P  [HDR-TH_2P-P2.54-V-M]  5.21 70.81 0 top
D1  -  [DO-41_BD2.4-L4.7-P8.70-D0.9-RD]  14.48 69.92 180 top
D2  -  [DO-41_BD2.4-L4.7-P8.70-D0.9-RD]  8.51 19.5 90 top
ESPNOW_LED_CONNECTOR  DB125-2.54-2P-GN-S  [CONN-TH_DB125-2.54-2P-GN]  5.84 65.6 270 top
H2  2.54-1*4P母  [HDR-TH_4P-P2.54-V-F]  35.69 5.02 180 top
H3  2.54-1*4P母  [HDR-TH_4P-P2.54-V-F]  49.78 6.29 270 top
H4  2.54-1*4P母  [HDR-TH_4P-P2.54-V-F]  53.09 6.29 270 top
H5  PM254V-11-06-H85  [HDR-TH_6P-P2.54-V-F]  35.69 8.07 0 top
MOTOR_A_CONNECTOR  DB125-2.54-2P-GN-S  [CONN-TH_DB125-2.54-2P-GN]  50.93 68.9 180 top
MOTOR_B_CONNECTOR  DB125-2.54-2P-GN-S  [CONN-TH_DB125-2.54-2P-GN]  42.93 68.9 180 top
POWER_LED_CONNECTOR  DB125-2.54-2P-GN-S  [CONN-TH_DB125-2.54-2P-GN]  5.84 58.87 270 top
Q1  TIP31C  [TO-220-3_L10.0-W4.5-P2.54-T]  35.56 60.52 180 top
Q2  BC547C  [TO-92-3_L4.9-W3.7-P1.27-L]  43.55 16.41 270 top
Q3  BC547C  [TO-92-3_L4.9-W3.7-P1.27-L]  43.55 22 270 top
Q4  BC547C  [TO-92-3_L4.9-W3.7-P1.27-L]  43.55 27.59 270 top
Q5  BC547C  [TO-92-3_L4.9-W3.7-P1.27-L]  43.55 33.18 270 top
R1  150  [RES-TH_BD2.3-L6.5-P10.50-D0.5]  17.53 61.41 270 top
R2  270  [RES-TH_BD2.3-L6.5-P10.50-D0.5]  14.48 61.41 270 top
R3  270  [RES-TH_BD2.3-L6.5-P10.50-D0.5]  11.43 61.41 90 top
R4  10k  [RES-TH_BD2.3-L6.5-P10.50-D0.5]  12.56 47.02 180 top
R5  20k  [RES-TH_BD2.3-L6.5-P10.50-D0.5]  12.56 50.45 0 top
R6  10k  [RES-TH_BD2.3-L6.5-P10.50-D0.5]  35.68 15.02 0 top
R7  10k  [RES-TH_BD2.3-L6.5-P10.50-D0.5]  35.68 17.81 180 top
R8  10k  [RES-TH_BD2.3-L6.5-P10.50-D0.5]  35.68 20.6 0 top
R9  10k  [RES-TH_BD2.3-L6.5-P10.50-D0.5]  35.68 23.4 180 top
R10  10k  [RES-TH_BD2.3-L6.5-P10.50-D0.5]  35.68 26.19 0 top
R11  10k  [RES-TH_BD2.3-L6.5-P10.50-D0.5]  35.68 28.99 180 top
R12  10k  [RES-TH_BD2.3-L6.5-P10.50-D0.5]  35.68 31.78 0 top
R13  10k  [RES-TH_BD2.3-L6.5-P10.50-D0.5]  35.68 34.57 180 top
SWITCH_CONNECTOR  DB125-2.54-2P-GN-S  [CONN-TH_DB125-2.54-2P-GN]  23.11 68.9 180 top
U1  L7805CV-DG  [TO-220-3_L10.0-W4.5-P2.54-L]  33.15 68.52 0 top
U2  LM741N  [DIP-8_L9.3-W6.4-P2.54-LS7.6-BL]  25.27 60.39 180 top
U3  L293D  [DIP-16_L20.0-W6.4-P2.54-LS7.6-BL]  41.27 46.51 0 top
U5  BX-PM2.54-1-15PY  [HDR-TH_15P-P2.54-V-F-1]  3.93 32.67 270 top
U6  BX-PM2.54-1-15PY  [HDR-TH_15P-P2.54-V-F-1]  26.79 32.67 90 top
U7  ZX-PM2.54-1-2PY  [HDR-TH_2P-P2.54-V-F]  45.34 6.55 270 top
U8  ZX-PM2.54-1-2PY  [HDR-TH_2P-P2.54-V-F]  26.04 6.55 90 top

## Footprints (pads in the part's own frame, mm; a bottom-side part is the same pattern mirrored in y, then rotated)
CONN-TH_DB125-2.54-2P-GN
  rect 1.8x1.8 hole 1.2: 1(-1.27,0)
  round 1.8 hole 1.2: 2(1.27,0)
DIP-8_L9.3-W6.4-P2.54-LS7.6-BL
  rect 1.8x1.8 hole 1: 1(-3.81,-3.81)
  round 1.8 hole 1: 2(-1.27,-3.81) 3(1.27,-3.81) 4(3.81,-3.81) 5(3.81,3.81) 6(1.27,3.81) 7(-1.27,3.81) 8(-3.81,3.81)
DIP-16_L20.0-W6.4-P2.54-LS7.6-BL
  round 1.6 hole 1: 1(-8.89,-3.81) 2(-6.35,-3.81) 3(-3.81,-3.81) 4(-1.27,-3.81) 5(1.27,-3.81) 6(3.81,-3.81) 7(6.35,-3.81) 8(8.89,-3.81) 9(8.89,3.81) 10(6.35,3.81) 11(3.81,3.81) 12(1.27,3.81) 13(-1.27,3.81) 14(-3.81,3.81) 15(-6.35,3.81) 16(-8.89,3.81)
DO-41_BD2.4-L4.7-P8.70-D0.9-RD
  round 1.8 hole 1: 1(-4.35,0) 2(4.35,0)
HDR-TH_2P-P2.54-V-F
  rect 1.7x1.7 hole 1: 1(-1.27,0)
  round 1.7 hole 1: 2(1.27,0)
HDR-TH_2P-P2.54-V-M
  rect 2x2 hole 1.2: 1(-1.27,0)
  round 2 hole 1.2: 2(1.27,0)
HDR-TH_4P-P2.54-V-F
  rect 1.7x1.7 hole 1.1: 1(-3.81,0)
  round 1.7 hole 1.1: 2(-1.27,0) 3(1.27,0) 4(3.81,0)
HDR-TH_6P-P2.54-V-F
  rect 1.8x1.8 hole 1.02: 1(-6.35,0)
  round 1.6 hole 1.02: 2(-3.81,0) 3(-1.27,0) 4(1.27,0) 5(3.81,0) 6(6.35,0)
HDR-TH_15P-P2.54-V-F-1
  rect 1.6x1.575 hole 1: 1(-17.78,0)
  round 1.6 hole 1: 2(-15.24,0) 3(-12.7,0) 4(-10.16,0) 5(-7.62,0) 6(-5.08,0) 7(-2.54,0) 8(0,0) 9(2.54,0) 10(5.08,0) 11(7.62,0) 12(10.16,0) 13(12.7,0) 14(15.24,0) 15(17.78,0)
RES-TH_BD2.3-L6.5-P10.50-D0.5
  round 1.4 hole 0.7: 1(-5.25,0) 2(5.25,0)
TO-92-3_L4.9-W3.7-P1.27-L
  rect 0.9x1.6 hole 0.7: 1(-1.27,0)
  oval 0.9x1.6 hole 0.7: 2(0,0) 3(1.27,0)
TO-220-3_L10.0-W4.5-P2.54-L
  rect 1.8x2.6 hole 1.2: 1(-2.54,0.005)
  oval 1.8x2.6 hole 1.2: 2(0,0.005) 3(2.54,-0.005)
TO-220-3_L10.0-W4.5-P2.54-T
  rect 2.5x2 hole 1.3: 1(0,2.54)
  oval 2.5x2 hole 1.3: 2(0,0) 3(0,-2.54)

## Nets
As in the schematic.

Pads without a net: U2 1 5 8; U5 2 3 10 11; U6 1 2 9 10

## Via types
v1: diameter 0.61, hole 0.305, Top Layer to Bottom Layer, 18 vias
v2: diameter 1.27, hole 0.75, Top Layer to Bottom Layer, 1 via

## Routing (per net, layer and track width the routed paths; a pad name or vN(x,y) marks a point on that pad's centre or on a via; arc(x,y) is an arc through that point)
+5V: length 256.2
  Top Layer w0.254: 50.16,50.45 48.89,49.18 33.65,49.18 32.38,50.45 ; v1(53.71,37.5) 53.69,37.52 v1(37.08,37.52) ; R3.1 v1(11.43,54.3) ; v1(16.45,54.3) 19.05,51.7 v1(19.05,51.63) ; 50.16,42.83 49.08,43.91 33.46,43.91 32.38,42.83
  Top Layer w1.27: 50.16,47.06 50.16,50.45 ; 50.16,47.06 50.16,42.83 ; 50.16,47.06 50.17,50.45 47.78,52.84 v2(47.78,54.33)
  Bottom Layer w0.254: 8.5,23.56 8.5,39.3 19.05,49.85 v1(19.05,51.63) ; R7.2 31.41,18.79 31.41,22.42 R9.2 31.41,24.38 31.41,28.01 R11.2 31.41,29.97 31.41,33.6 R13.2 33.38,37.52 v1(37.08,37.52) ; 19.84,54.28 19.84,57.51 U2.2
  Bottom Layer w1.27: 35.56,63.19 35.69,63.06 37.96,63.06 40.26,60.77 40.26,54.28 ; H4.4 H4.3 H4.2 H4.1 53.09,14.04 53.68,14.64 53.68,51.03 50.44,54.28 40.26,54.28 ; 40.26,54.28 7.64,54.28
GND: length 256.7
  Top Layer w0.254: v1(12.48,52.94) 12.48,57.26 19.43,64.2 U2.4
  Bottom Layer w0.254: Q2.3 52.25,15.14 ; U2.4 23.09,65.83 30.5,65.83 31.79,67.11 31.79,67.17 U1.2 ; U5.14 5.68,17.43 19.94,31.69 19.94,49.08 ; U3.4 U3.5 ; U3.5 U3.12 U3.13 ; U3.5 46.59,46.75 52.3,46.75 ; 52.3,31.92 52.29,31.91 Q5.3 ; 52.3,20.75 52.28,20.73 Q3.3 ; 3.94,57.62 5.82,57.62 POWER_LED_CONNECTOR.2 ; 19.94,49.14 19.86,52.9 ; 19.94,49.14 R4.1 ; 19.94,49.14 19.94,49.08 ; 52.3,26.33 52.29,26.32 Q4.3 ; 19.94,49.08 19.94,49.15 ; ESPNOW_LED_CONNECTOR.2 3.95,64.33 3.94,64.32
  Bottom Layer w1.27: 52.3,46.75 52.3,43.36 ; 52.3,43.36 52.3,15.2 49.78,12.68 H3.1 H3.2 H3.3 H3.4 ; 52.3,43.36 52.31,50.47 49.87,52.9 6.98,52.9 3.94,55.94 BATTERY_CONNECTOR.1
  vias: v1(17.02,52.9)
BATT_SUPPLY: length 56.8
  Top Layer w0.254: 31.93,61.61 31.75,61.43 31.75,56.58 30.57,55.41 27.72,55.41 22.73,60.39 16.12,60.39 12.84,57.11 12.84,55.42 R5.2 ; 28.06,65.93 30.61,68.48 U1.1
  Top Layer w1.27: SWITCH_CONNECTOR.1 27.4,65.89 30.44,65.89 31.75,64.59 31.75,61.79 33.02,60.52 Q1.2 35.69,60.65
ESPNOW_LED+: length 34.6
  Top Layer w0.254: v1(20.52,51.63) 15.99,56.16 R2.2
  Bottom Layer w0.254: 20.52,51.61 20.52,33.72 26.76,27.47
MOTOR_A_SIGNAL+: length 13.6
  Top Layer w0.254: U6.8 28.67,30.79 28.67,22.36 R8.1
MOTOR_A_SIGNAL-: length 16.6
  Top Layer w0.254: U6.7 28.31,28.6 28.31,17.13 R6.1
MOTOR_B_SIGNAL+: length 20.6
  Top Layer w0.254: 30.41,26.28 29.09,27.59 29.09,43.1 26.77,45.42
MOTOR_B_SIGNAL-: length 17.7
  Top Layer w0.254: 30.45,31.77 29.45,32.77 29.45,45.19 26.73,47.91
$1N457: length 4
  Top Layer w1.27: BATTERY_CONNECTOR.2 9.24,70.81 D1.2
$1N1221: length 23.1
  Top Layer w0.254: R1.2 19.64,54.04 24,54.04 ; 24,54.04 31.62,54.04 Q1.1 ; 24,54.04 24,56.58
$1N2036: length 6.8
  Top Layer w0.254: U5.1 R5.1 R4.2
$1N10174: length 3.2
  Top Layer w0.254: Q3.2 42.33,22 R8.2
$1N10175: length 3.2
  Top Layer w0.254: R6.2 42.33,16.41 Q2.2
$1N10193: length 3.2
  Top Layer w0.254: Q5.2 42.33,33.18 R12.2
$1N10200: length 43
  Top Layer w0.254: v1(36.15,51.76) 31.78,51.76 30.5,50.47 30.5,41.92 36.19,36.23 39.28,36.23 R13.1 43.43,34.57 Q5.1
  Bottom Layer w0.254: v1(36.15,51.76) 46.18,51.76 U3.10
$1N10623: length 21
  Top Layer w0.254: U2.3 21.55,66.66 R1.1
  Bottom Layer w0.254: U2.3 25.27,65.47 32.64,65.47 U1.3
$1N11035: length 5.1
  Top Layer w0.254: 3.8,14.89 5.8,14.89 6.06,15.15 8.51,15.15 8.5,15.14 8.5,14.86
$1N11313: length 3.2
  Top Layer w0.254: R10.2 42.33,27.59 Q4.2
$1N11315: length 43.1
  Top Layer w0.254: R11.1 43.43,28.99 Q4.1 46.9,32.21 46.9,36.18 46.5,36.58 36.34,36.58 30.85,42.07 30.85,50.32 31.93,51.4 33.84,51.4 U3.15
$1N11419: length 29.4
  Top Layer w0.254: R7.1 43.43,17.81 Q2.1 47.62,21.75 v1(47.62,36.86)
  Bottom Layer w0.254: v1(47.62,36.86) U3.7
$1N11580: length 3.4
  Top Layer w1.27: SWITCH_CONNECTOR.2 20.83,69.92 D1.1
$1N11617: length 20.3
  Top Layer w1.27: U3.14 41.66,54.52 MOTOR_B_CONNECTOR.2
$1N11623: length 18.8
  Top Layer w1.27: 44.2,51.33 MOTOR_B_CONNECTOR.1 ; 44.2,51.33 45.08,50.45 ; 44.2,51.33 44.19,51.34
$1N11647: length 48.3
  Top Layer w1.27: 37.46,42.83 37.46,41.31 40.35,38.41 50.74,38.41 53.68,41.35 53.68,54.72 52.2,56.2 MOTOR_A_CONNECTOR.1
$1N11652: length 38.7
  Top Layer w1.27: 45.08,42.83 45.08,40.68 45.97,39.78 50.17,39.78 52.3,41.91 52.3,54.16 49.66,56.8 MOTOR_A_CONNECTOR.2
$1N12198: length 34.7
  Top Layer w0.254: R9.1 43.43,23.4 Q3.1 47.26,26.98 47.26,36.32 46.65,36.94 36.49,36.94 34.92,38.51 U3.2
$1N14456: length 62.2
  Top Layer w0.254: H5.6 42.04,11.88 41.73,12.19 24.98,12.19 7.65,29.52 7.65,42.21 7.02,42.83 U5.4
$1N14458: length 56.9
  Top Layer w0.254: H5.5 39.5,11.37 39.04,11.83 24.83,11.83 7.29,29.37 7.29,39.77 6.77,40.29 U5.5
$1N14460: length 51.9
  Top Layer w0.254: U5.6 6.52,37.75 6.94,37.33 6.94,29.22 24.68,11.47 36.6,11.47 36.96,11.12 H5.4
$1N14464: length 41.5
  Top Layer w0.254: U5.8 5.75,32.67 6.22,32.2 6.22,28.93 24.39,10.76 31.73,10.76 31.88,10.61 H5.2
$1N14466: length 36.2
  Top Layer w0.254: U5.9 5.5,30.13 5.87,29.76 5.87,28.78 24.24,10.41 28.91,10.41 29.34,9.98 H5.1
$1N14472: length 29.2
  Top Layer w0.254: U8.2 25.78,8.07 24.38,8.07 24.2,8.25 24.2,9.94 11.63,22.51 U5.12
$1N14474: length 30.6
  Top Layer w0.254: U8.1 24.26,5.28 23.85,5.69 23.85,9.79 13.67,19.97 U5.13
$1N14884: length 79
  Top Layer w0.254: H2.1 39.5,1.41 39.24,1.16 25.34,1.16 15.52,10.98 15.52,16.76 v1(15.79,17.03) ; U6.15 21.42,50.45 21,50.02 21,22.49 v1(18.25,19.74)
  Bottom Layer w0.254: v1(18.25,19.74) 18.25,19.49 v1(15.79,17.03)
$1N14895: length 58.6
  Top Layer w0.254: 19.35,18.66 21.71,21.02 21.71,35.42 26.71,40.41 ; H2.3 34.42,2.13 34.16,1.87 25.63,1.87 16.23,11.27 16.23,15.32 v1(16.86,15.95)
  Bottom Layer w0.254: v1(19.33,18.66) 19.33,18.41 v1(16.86,15.95)
$1N14901: length 42.1
  Top Layer w0.254: H2.4 31.88,2.48 31.62,2.23 25.78,2.23 16.59,11.42 16.59,14.6 v1(17.4,15.41) ; v1(19.86,18.13) 22.07,20.33 22.07,24.68 22.44,25.05 U6.5
  Bottom Layer w0.254: v1(17.4,15.41) 19.86,17.87 v1(19.86,18.13)
$1N15015: length 38.4
  Top Layer w0.254: U6.3 25.23,19.97 25.02,19.75 25.02,13.15 25.27,12.9 45.72,12.9 46.97,11.65 46.97,6.39 45.85,5.28 U7.2
$1N15020: length 38.6
  Top Layer w0.254: U6.4 24.84,22.51 24.66,22.33 24.66,13 25.13,12.54 45.57,12.54 46.61,11.5 46.61,8.58 45.85,7.82 U7.1
$1N17013: length 46.7
  Top Layer w0.254: U5.7 6.14,35.21 6.58,34.77 6.58,29.07 24.54,11.12 34.17,11.12 34.42,10.86 H5.3
$1N17025: length 10.8
  Top Layer w0.254: POWER_LED_CONNECTOR.1 9.27,60.14 9.65,60.52 9.65,64.88 R3.2
$1N17035: length 9.4
  Top Layer w0.254: ESPNOW_LED_CONNECTOR.1 10.26,66.87 11.02,67.64 11.84,67.64 12.6,66.87 14.27,66.87 R2.1
$1N19581: length 64.6
  Top Layer w0.254: H2.2 36.96,1.77 36.7,1.52 25.49,1.52 15.88,11.13 15.88,16.04 v1(16.32,16.49) ; 18.77,19.21 21.35,21.79 21.35,37.39 26.78,42.82
  Bottom Layer w0.254: v1(18.79,19.2) 18.79,18.95 v1(16.32,16.49)

## Text on the board
Top Silkscreen Layer: Designed by Daniel Denison | 20k | 10k | RST | EN | CLK | SD0 | D8 | CMD | D7 | SD1 | D6 | 1k | SD2 | D5 | SD3 | RX | TX | 270 | 150 | GND | 5V | BATT | SWITCH | L-MOTOR | R-MOTOR | USR_LED | POW_LED | - | + | Tank Motherboard V4
